# Altium schematic sheet 02.SchDoc
size 297 x 209 mm
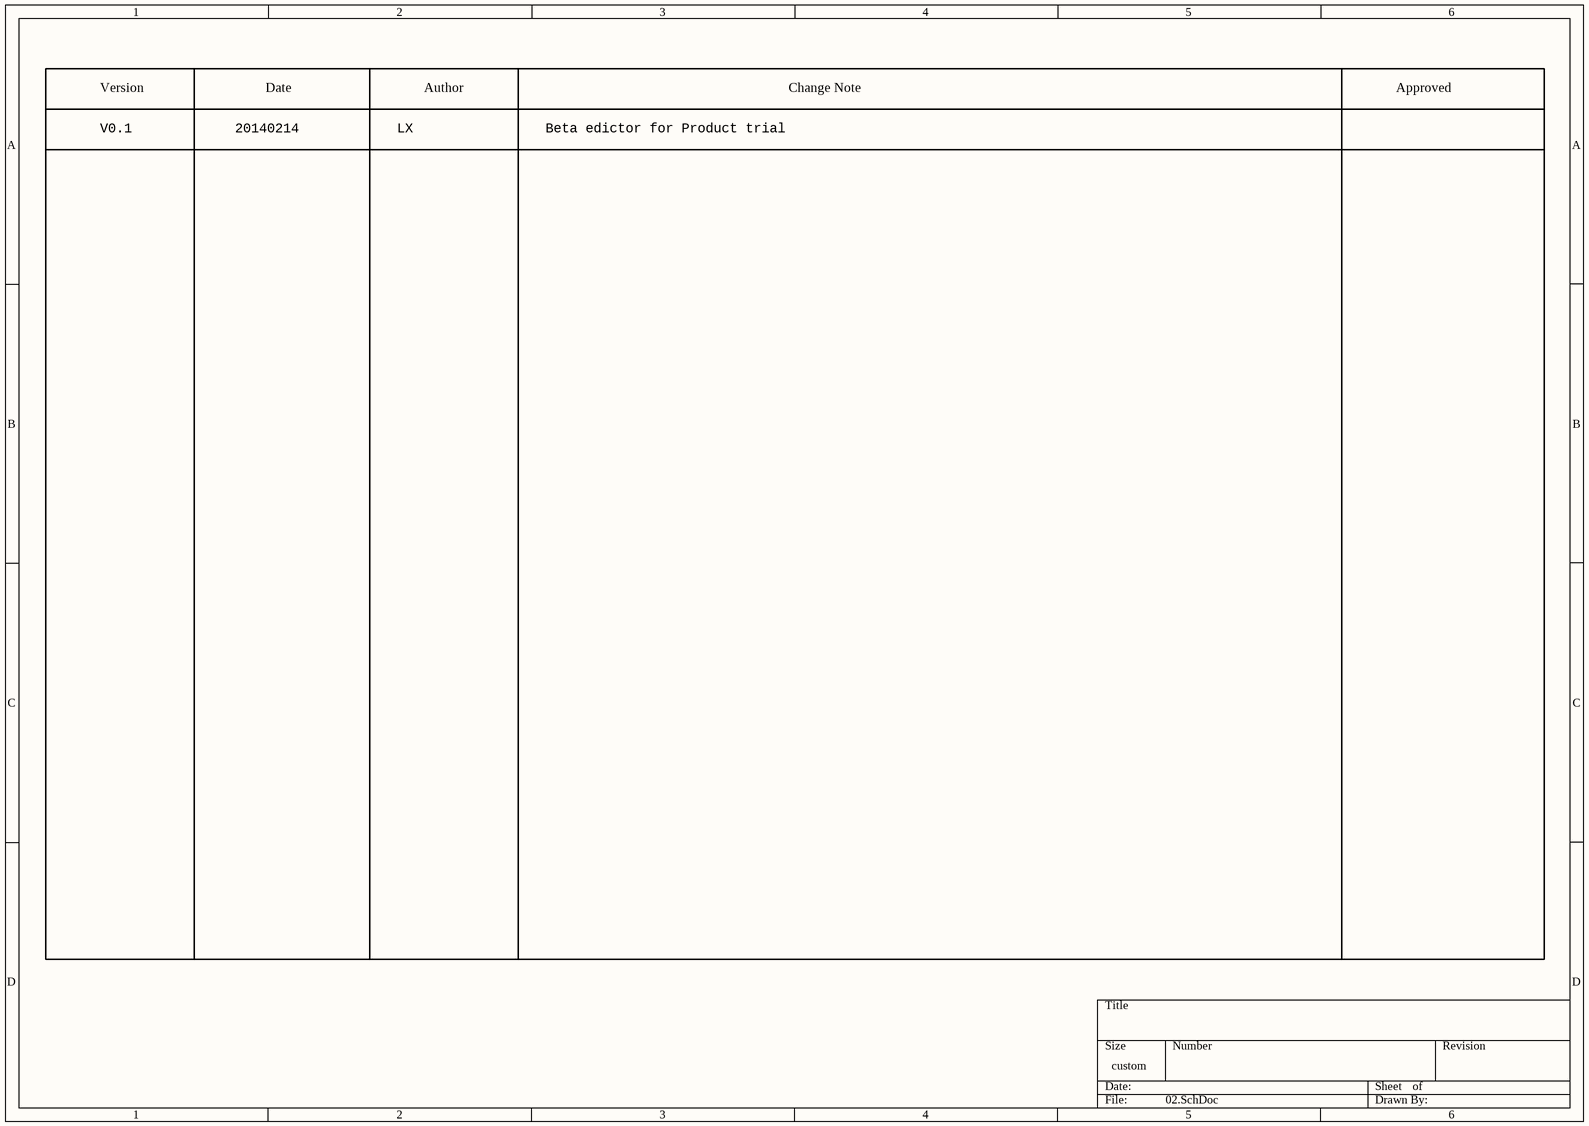
[diagram p0: 02.SchDoc]

## Notes on the sheet
- Version
- V0.1
- 20140214
- Date
- LX
- Author
- Beta edictor for Product trial
- Change Note
- Approved